# Altium schematic sheet main.SchDoc
size A
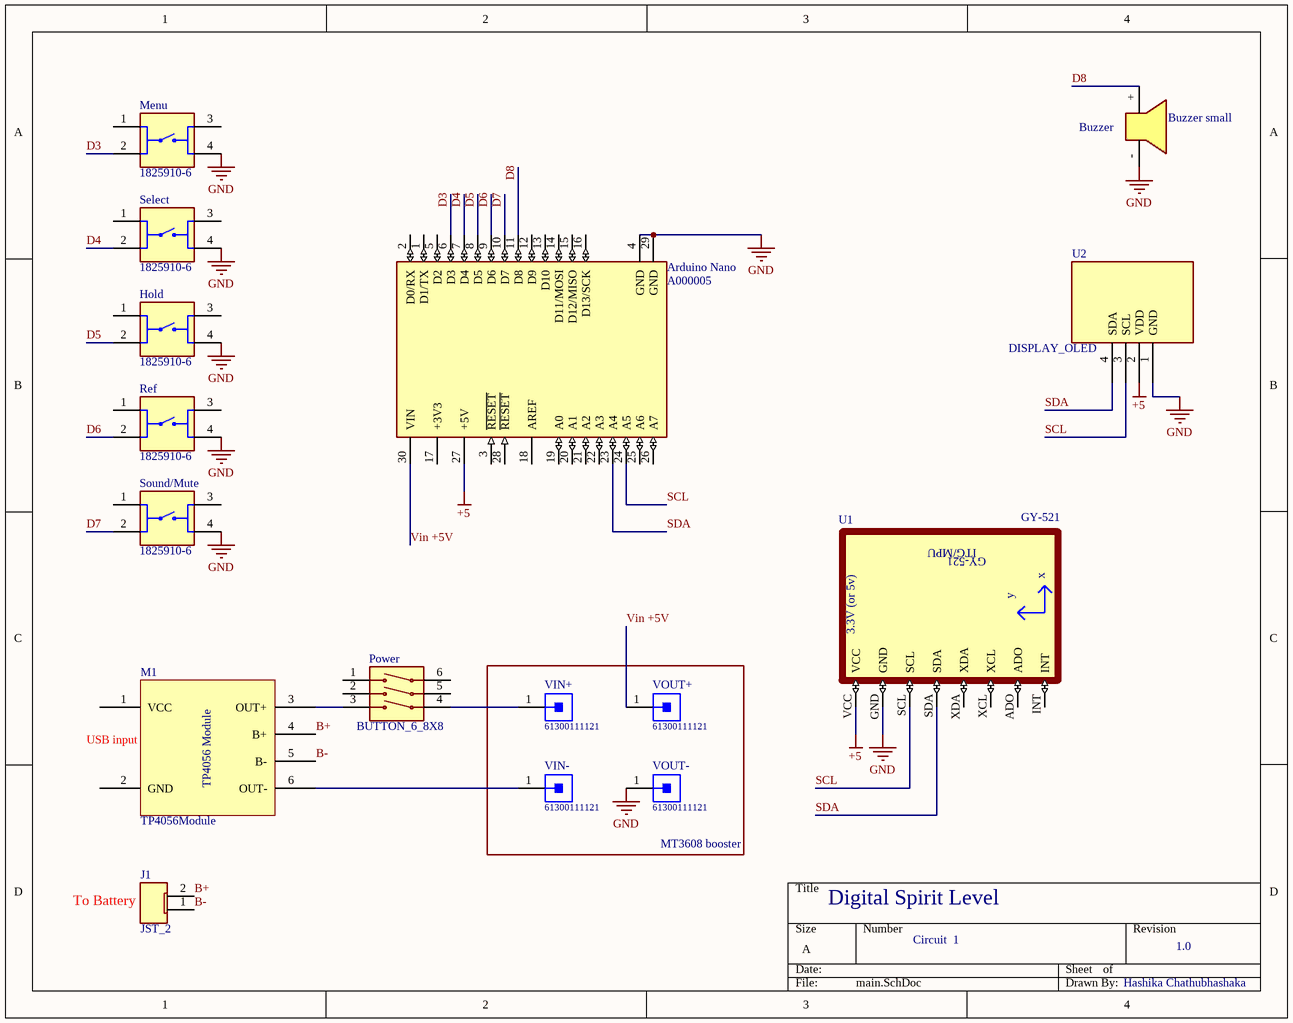
[diagram p0: main.SchDoc]

## Parts
Arduino_Nano  A000005  [FP-A000005-MFG]
Buzzer  Buzzer small  [Buzzer]
Hold  1825910-6  [SW_1825910-6-4]
J1  JST_2  [JST_2]
M1  TP4056Module  [TP4056Module]
Menu  1825910-6  [SW_1825910-6-4]
Power  BUTTON_6_8X8  [BUTTON_6_8x8]
Ref  1825910-6  [SW_1825910-6-4]
Select  1825910-6  [SW_1825910-6-4]
Sound/Mute  1825910-6  [SW_1825910-6-4]
U1  GY-521  [GY-521]
U2  DISPLAY_OLED  [DISPLAY_OLED]
VIN+  61300111121  [61300111121]
VIN-  61300111121  [61300111121]
VOUT+  61300111121  [61300111121]
VOUT-  61300111121  [61300111121]

## Blocks framed on the sheet
MT3608 booster: VIN+ VIN- VOUT+ VOUT-

## Nets
+5: Arduino_Nano.27(+5V) U1.VCC U2.2(VDD)
GND: Arduino_Nano.4(GND) Arduino_Nano.29(GND) Buzzer.- Hold.4 Menu.4 Ref.4 Select.4 Sound/Mute.4 U1.GND U2.1(GND) VOUT-.1
B+: J1.2 M1.4(B+)
B-: J1.1 M1.5(B-)
D3: Arduino_Nano.6(D3) Menu.2
D4: Arduino_Nano.7(D4) Select.2
D5: Arduino_Nano.8(D5) Hold.2
D6: Arduino_Nano.9(D6) Ref.2
D7: Arduino_Nano.10(D7) Sound/Mute.2
D8: Arduino_Nano.11(D8) Buzzer.+
SCL: Arduino_Nano.24(A5) U1.SCL U2.3(SCL)
SDA: Arduino_Nano.23(A4) U1.SDA U2.4(SDA)
Vin +5V: Arduino_Nano.30(VIN) VOUT+.1
NetM1_3: M1.3(OUT+) Power.3
NetM1_6: M1.6(OUT-) VIN-.1
NetPower_4: Power.4 VIN+.1

Not connected (* = marked no-connect by the designer): Arduino_Nano 1(D1/TX) 2(D0/RX) 3(~{RESET}) 5(D2) 12(D9) 13(D10) 14(D11/MOSI) 15(D12/MISO) 16(D13/SCK) 17(+3V3) 18(AREF) 19(A0) 20(A1) 21(A2) 22(A3) 25(A6) 26(A7) 28(~{RESET}); Hold 1 3; M1 1(VCC) 2(GND); Menu 1 3; Power 1 2 5 6; Ref 1 3; Select 1 3; Sound/Mute 1 3; U1 ADO INT XCL XDA

## Notes on the sheet
- (near M1) USB input
- (near J1) To Battery
- Digital Spirit Level
- Circuit  1
- 1.0
- Hashika Chathubhashaka
- (in symbol GY-521) ITG/MPU; x; y; 3.3V (or 5v)
- (in symbol TP4056Module) TP4056 Module

## Library data of the parts
Arduino_Nano = CMP-189986-000002-1: ARDUINO NANO ATMEGA328 EVAL BRD; Number of Bits: 8; Evaluation Kit: Yes; Operating Supply Voltage: 12V; Interface: I2C; Data Bus Width: 8b; Core Architecture: AVR; Packaging: Bulk; Length: 7inch; Package Quantity: 50; Width: 5inch; REACH SVHC: No SVHC; Weight: 0.358383oz; Series: AVR® ATmega; Height: 0.25inch
Buzzer = Buzzer: 5-12v small buzzer (12mm)
Hold Menu Ref Select Sound/Mute = 1825910-6: Switch Push Button OFF (ON) SPST Round Button 0.05A 24VDC Momentary Contact PC Pins Thru-Hole; MF: TE Connectivity; Value: *; MP: 1825910-6; Package: None; Check_prices: https://www.snapeda.com/parts/1825910-6/TE+Connectivity+ALCOSWITCH+Switches/view-part/?ref=eda; SnapEDA_Link: https://www.snapeda.com/parts/1825910-6/TE+Connectivity+ALCOSWITCH+Switches/view-part/?ref=snap; Digi-Key_Part_Number: 450-1650-ND; Purchase-URL: https://pricing.snapeda.com/search/part/1825910-6/?ref=eda
M1 = TP4056Module: TP4056 Module for managing battery charging
U1 = GY-521: Triple Axis Accelerometer Gyro Breakout; MF: GODREAM FORDREAM CO., LIMITED; Price: None; MP: GY-521; SnapEDA_Link: https://www.snapeda.com/parts/GY-521/GODREAM+FORDREAM+CO.%252C+LIMITED/view-part/?ref=snap; Package: Package; Availability: Not in stock; Check_prices: https://www.snapeda.com/parts/GY-521/GODREAM+FORDREAM+CO.%252C+LIMITED/view-part/?ref=eda; Value: *
VIN+ VIN- VOUT+ VOUT- = CMP-1502-01058-1: THT Vertical Pin Header WR-PHD, Pitch 2.54 mm, Single Row, 1 pins; Manufacturer: Wurth Elektronik; Gender: Male; Working Voltage: 250VAC; Withstanding Voltage: 500VAC; Pin Number: 1; Contact Resistance: 20mOhm; Rated Current: 3A; Pitch: 2.54mm; Mounting Technology: THT; Datasheet URL: https://katalog.we-online.de/em/datasheet/6130xx11121.pdf; Manufacturer URL: http://www.we-online.de; Operating Temperature: -40to105degC; Publisher: WurthElektronik; Part Number: 61300111121; Row Number: Single; Package Reference: 61300111121; Orientation: Vertical; Packaging: Bag